# EAGLE design led wall display (EAGLE 4.16)

## Sheet 1 of 3
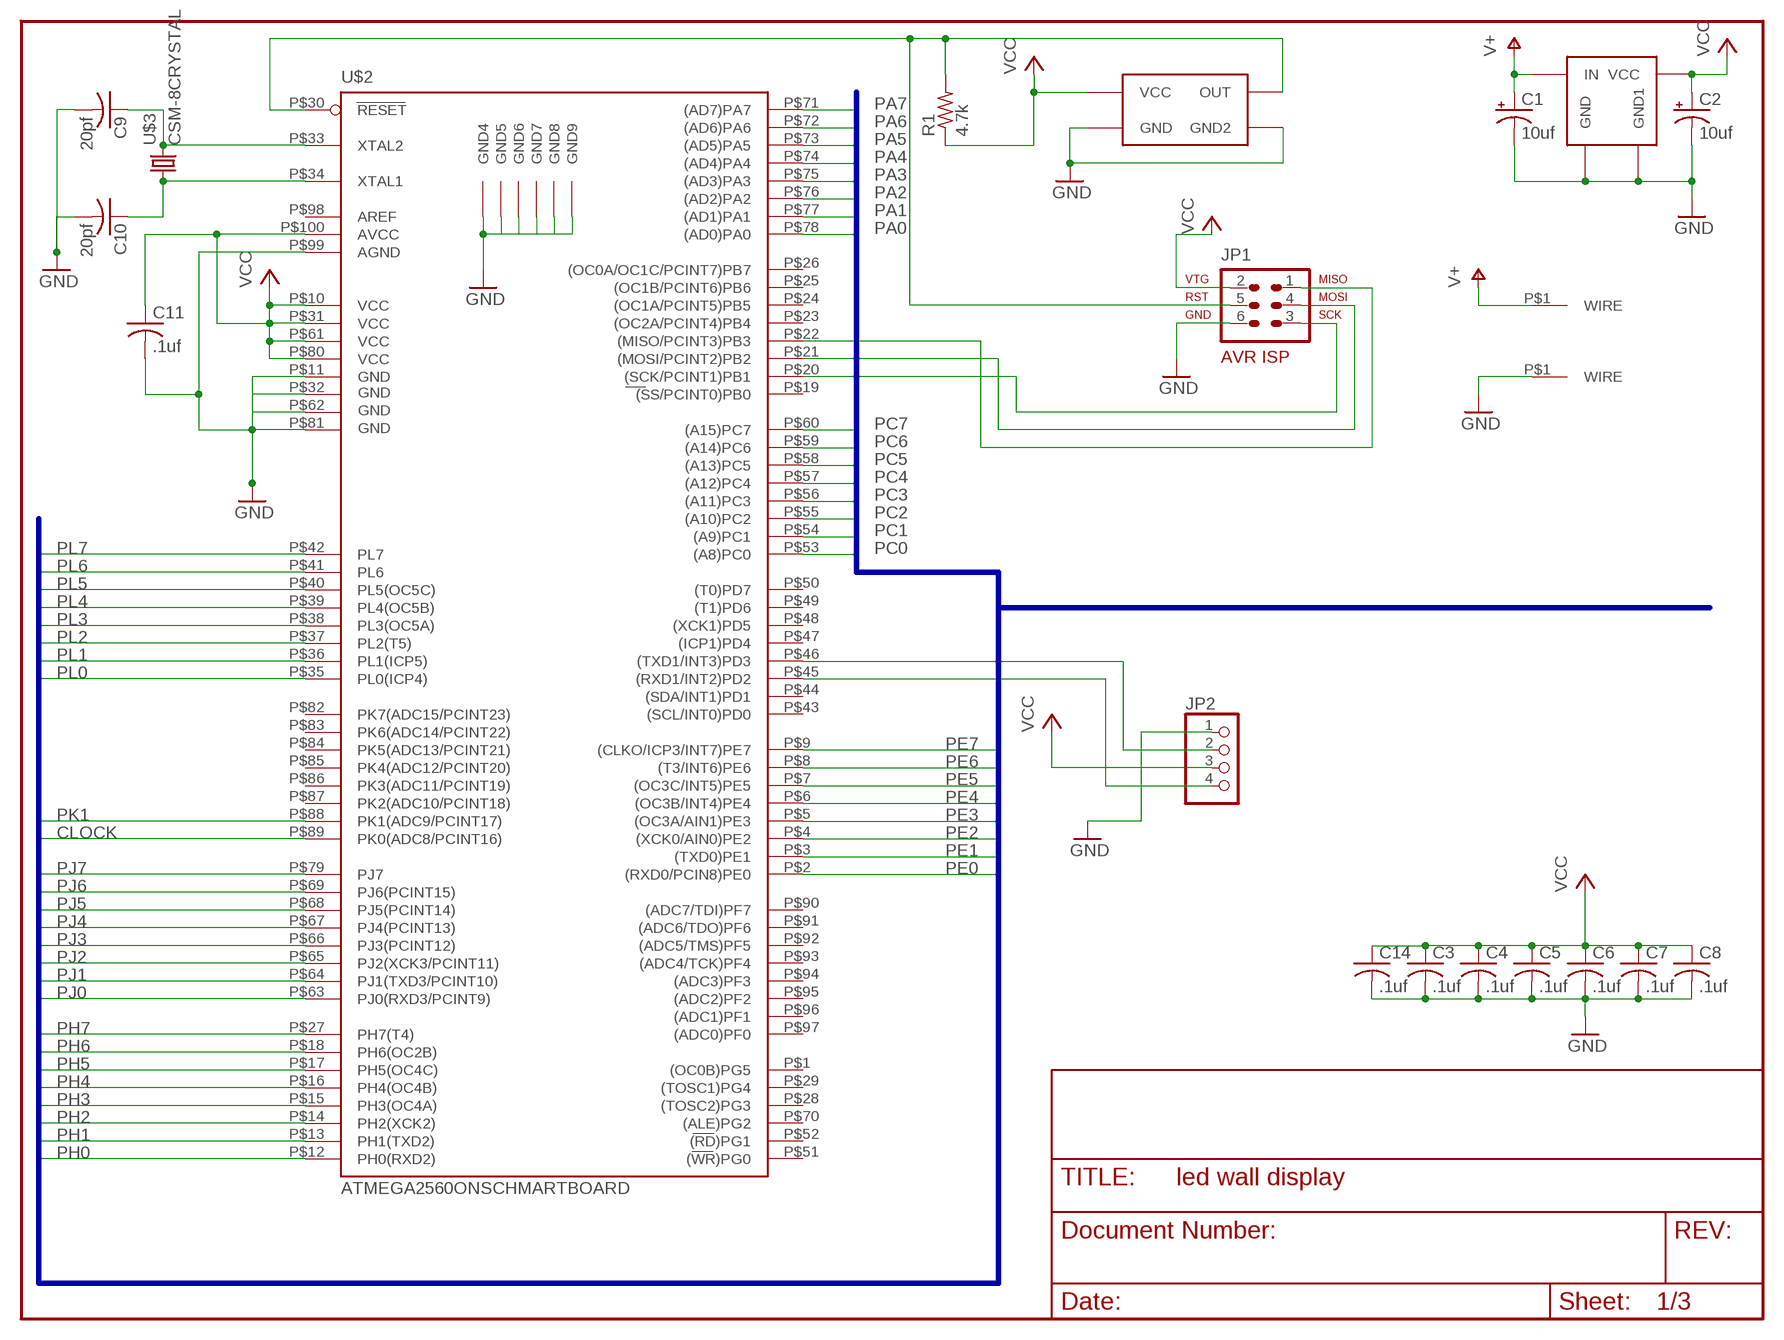
[diagram p0: schematic, sheet 1]

### Parts
C1  10uf  CPOL-USE2-5  [E2-5]
C2  10uf  CPOL-USE2-5  [E2-5]
C3  .1uf  C-USC1206  [C1206]
C4  .1uf  C-USC1206  [C1206]
C5  .1uf  C-USC1206  [C1206]
C6  .1uf  C-USC1206  [C1206]
C7  .1uf  C-USC1206  [C1206]
C8  .1uf  C-USC1206  [C1206]
C9  20pf  C-USC1206  [C1206]
C10  20pf  C-USC1206  [C1206]
C11  .1uf  C-USC1206  [C1206]
C14  .1uf  C-USC1206  [C1206]
JP1  AVR-ISP-6  [AVR-ISP-6]
JP2  PINHD-1X4  [1X04]
R1  4.7k  R-US_0411/12  [0411/12]
U$1  ZM33064  [SOT223]
U$2  ATMEGA2560ONSCHMARTBOARD  [SCHMARTBOARD]
U$3  CSM-8CRYSTAL  [CSM-8A]
U$4  5VREGD2PAK/A  [TO263]
U$5  WIREHOLE  [WIREHOLE]
U$6  WIREHOLE  [WIREHOLE]

### Nets
CLOCK: U$2.P$89(PK0(ADC8/PCINT16)) ; also sheet 2,3
GND: C1.- C2.- C3.2 C4.2 C5.2 C6.2 C7.2 C8.2 C9.2 C10.2 C11.2 C14.2 JP1.6 JP2.1 U$1.2(GND) U$1.4(GND2) U$2.P$11(GND) U$2.P$32(GND1) U$2.P$62(GND2) U$2.P$81(GND3) U$2.P$99(AGND) U$2.P$101(GND4) U$2.P$102(GND5) U$2.P$103(GND6) U$2.P$104(GND7) U$2.P$105(GND8) U$2.P$106(GND9) U$4.P$1(GND) U$4.P$3(GND1) U$6.P$1(WIRE) ; also sheet 2,3
N$1: C10.1 U$2.P$34(XTAL1) U$3.1
N$2: C9.1 U$2.P$33(XTAL2) U$3.2
N$3: JP1.5 R1.2 U$1.3(OUT) U$2.P$30(RESET)
N$4: JP1.3 U$2.P$20((SCK/PCINT1)PB1)
N$5: JP1.4 U$2.P$21((MOSI/PCINT2)PB2)
N$6: JP1.1 U$2.P$22((MISO/PCINT3)PB3)
N$121: JP2.2 U$2.P$46((TXD1/INT3)PD3)
N$122: JP2.4 U$2.P$45((RXD1/INT2)PD2)
PA0: U$2.P$78((AD0)PA0) ; also sheet 2
PA1: U$2.P$77((AD1)PA1) ; also sheet 2
PA2: U$2.P$76((AD2)PA2) ; also sheet 2
PA3: U$2.P$75((AD3)PA3) ; also sheet 2
PA4: U$2.P$74((AD4)PA4) ; also sheet 2
PA5: U$2.P$73((AD5)PA5) ; also sheet 2
PA6: U$2.P$72((AD6)PA6) ; also sheet 2
PA7: U$2.P$71((AD7)PA7) ; also sheet 2
PC0: U$2.P$53((A8)PC0) ; also sheet 2
PC1: U$2.P$54((A9)PC1) ; also sheet 2
PC2: U$2.P$55((A10)PC2) ; also sheet 2
PC3: U$2.P$56((A11)PC3) ; also sheet 2
PC4: U$2.P$57((A12)PC4) ; also sheet 2
PC5: U$2.P$58((A13)PC5) ; also sheet 2
PC6: U$2.P$59((A14)PC6) ; also sheet 2
PC7: U$2.P$60((A15)PC7) ; also sheet 2
PE0: U$2.P$2((RXD0/PCIN8)PE0) ; also sheet 2
PE1: U$2.P$3((TXD0)PE1) ; also sheet 2
PE2: U$2.P$4((XCK0/AIN0)PE2) ; also sheet 2
PE3: U$2.P$5((OC3A/AIN1)PE3) ; also sheet 2
PE4: U$2.P$6((OC3B/INT4)PE4) ; also sheet 2
PE5: U$2.P$7((OC3C/INT5)PE5) ; also sheet 2
PE6: U$2.P$8((T3/INT6)PE6) ; also sheet 2
PE7: U$2.P$9((CLKO/ICP3/INT7)PE7) ; also sheet 2
PH0: U$2.P$12(PH0(RXD2)) ; also sheet 2
PH1: U$2.P$13(PH1(TXD2)) ; also sheet 2
PH2: U$2.P$14(PH2(XCK2)) ; also sheet 2
PH3: U$2.P$15(PH3(OC4A)) ; also sheet 2
PH4: U$2.P$16(PH4(OC4B)) ; also sheet 2
PH5: U$2.P$17(PH5(OC4C)) ; also sheet 2
PH6: U$2.P$18(PH6(OC2B)) ; also sheet 2
PH7: U$2.P$27(PH7(T4)) ; also sheet 2
PJ0: U$2.P$63(PJ0(RXD3/PCINT9)) ; also sheet 2
PJ1: U$2.P$64(PJ1(TXD3/PCINT10)) ; also sheet 2
PJ2: U$2.P$65(PJ2(XCK3/PCINT11)) ; also sheet 2
PJ3: U$2.P$66(PJ3(PCINT12)) ; also sheet 2
PJ4: U$2.P$67(PJ4(PCINT13)) ; also sheet 2
PJ5: U$2.P$68(PJ5(PCINT14)) ; also sheet 2
PJ6: U$2.P$69(PJ6(PCINT15)) ; also sheet 2
PJ7: U$2.P$79(PJ7) ; also sheet 2
PK1: U$2.P$88(PK1(ADC9/PCINT17)) ; also sheet 3
PL0: U$2.P$35(PL0(ICP4)) ; also sheet 2
PL1: U$2.P$36(PL1(ICP5)) ; also sheet 2
PL2: U$2.P$37(PL2(T5)) ; also sheet 2
PL3: U$2.P$38(PL3(OC5A)) ; also sheet 2
PL4: U$2.P$39(PL4(OC5B)) ; also sheet 2
PL5: U$2.P$40(PL5(OC5C)) ; also sheet 2
PL6: U$2.P$41(PL6) ; also sheet 2
PL7: U$2.P$42(PL7) ; also sheet 2
V+: C1.+ U$4.P$2(IN) U$5.P$1(WIRE)
VCC: C2.+ C3.1 C4.1 C5.1 C6.1 C7.1 C8.1 C11.1 C14.1 JP1.2 JP2.3 R1.1 U$1.1(VCC) U$2.P$10(VCC) U$2.P$31(VCC1) U$2.P$61(VCC2) U$2.P$80(VCC3) U$2.P$100(AVCC) U$4.P$4(VCC)
Unconnected: U$2.P$1((OC0B)PG5) U$2.P$19((SS/PCINT0)PB0) U$2.P$23((OC2A/PCINT4)PB4) U$2.P$24((OC1A/PCINT5)PB5) U$2.P$25((OC1B/PCINT6)PB6) U$2.P$26((OC0A/OC1C/PCINT7)PB7) U$2.P$28((TOSC2)PG3) U$2.P$29((TOSC1)PG4) U$2.P$43((SCL/INT0)PD0) U$2.P$44((SDA/INT1)PD1) U$2.P$47((ICP1)PD4) U$2.P$48((XCK1)PD5) U$2.P$49((T1)PD6) U$2.P$50((T0)PD7) U$2.P$51((WR)PG0) U$2.P$52((RD)PG1) U$2.P$70((ALE)PG2) U$2.P$82(PK7(ADC15/PCINT23)) U$2.P$83(PK6(ADC14/PCINT22)) U$2.P$84(PK5(ADC13/PCINT21)) U$2.P$85(PK4(ADC12/PCINT20)) U$2.P$86(PK3(ADC11/PCINT19)) U$2.P$87(PK2(ADC10/PCINT18)) U$2.P$90((ADC7/TDI)PF7) U$2.P$91((ADC6/TDO)PF6) U$2.P$92((ADC5/TMS)PF5) U$2.P$93((ADC4/TCK)PF4) U$2.P$94((ADC3)PF3) U$2.P$95((ADC2)PF2) U$2.P$96((ADC1)PF1) U$2.P$97((ADC0)PF0) U$2.P$98(AREF)

### Buses
PA[0..7],PC[0..7],PE[0..7],PH[0..7],PJ[0..7],PL[0..7],CLOCK,PK1

## Sheet 2 of 3
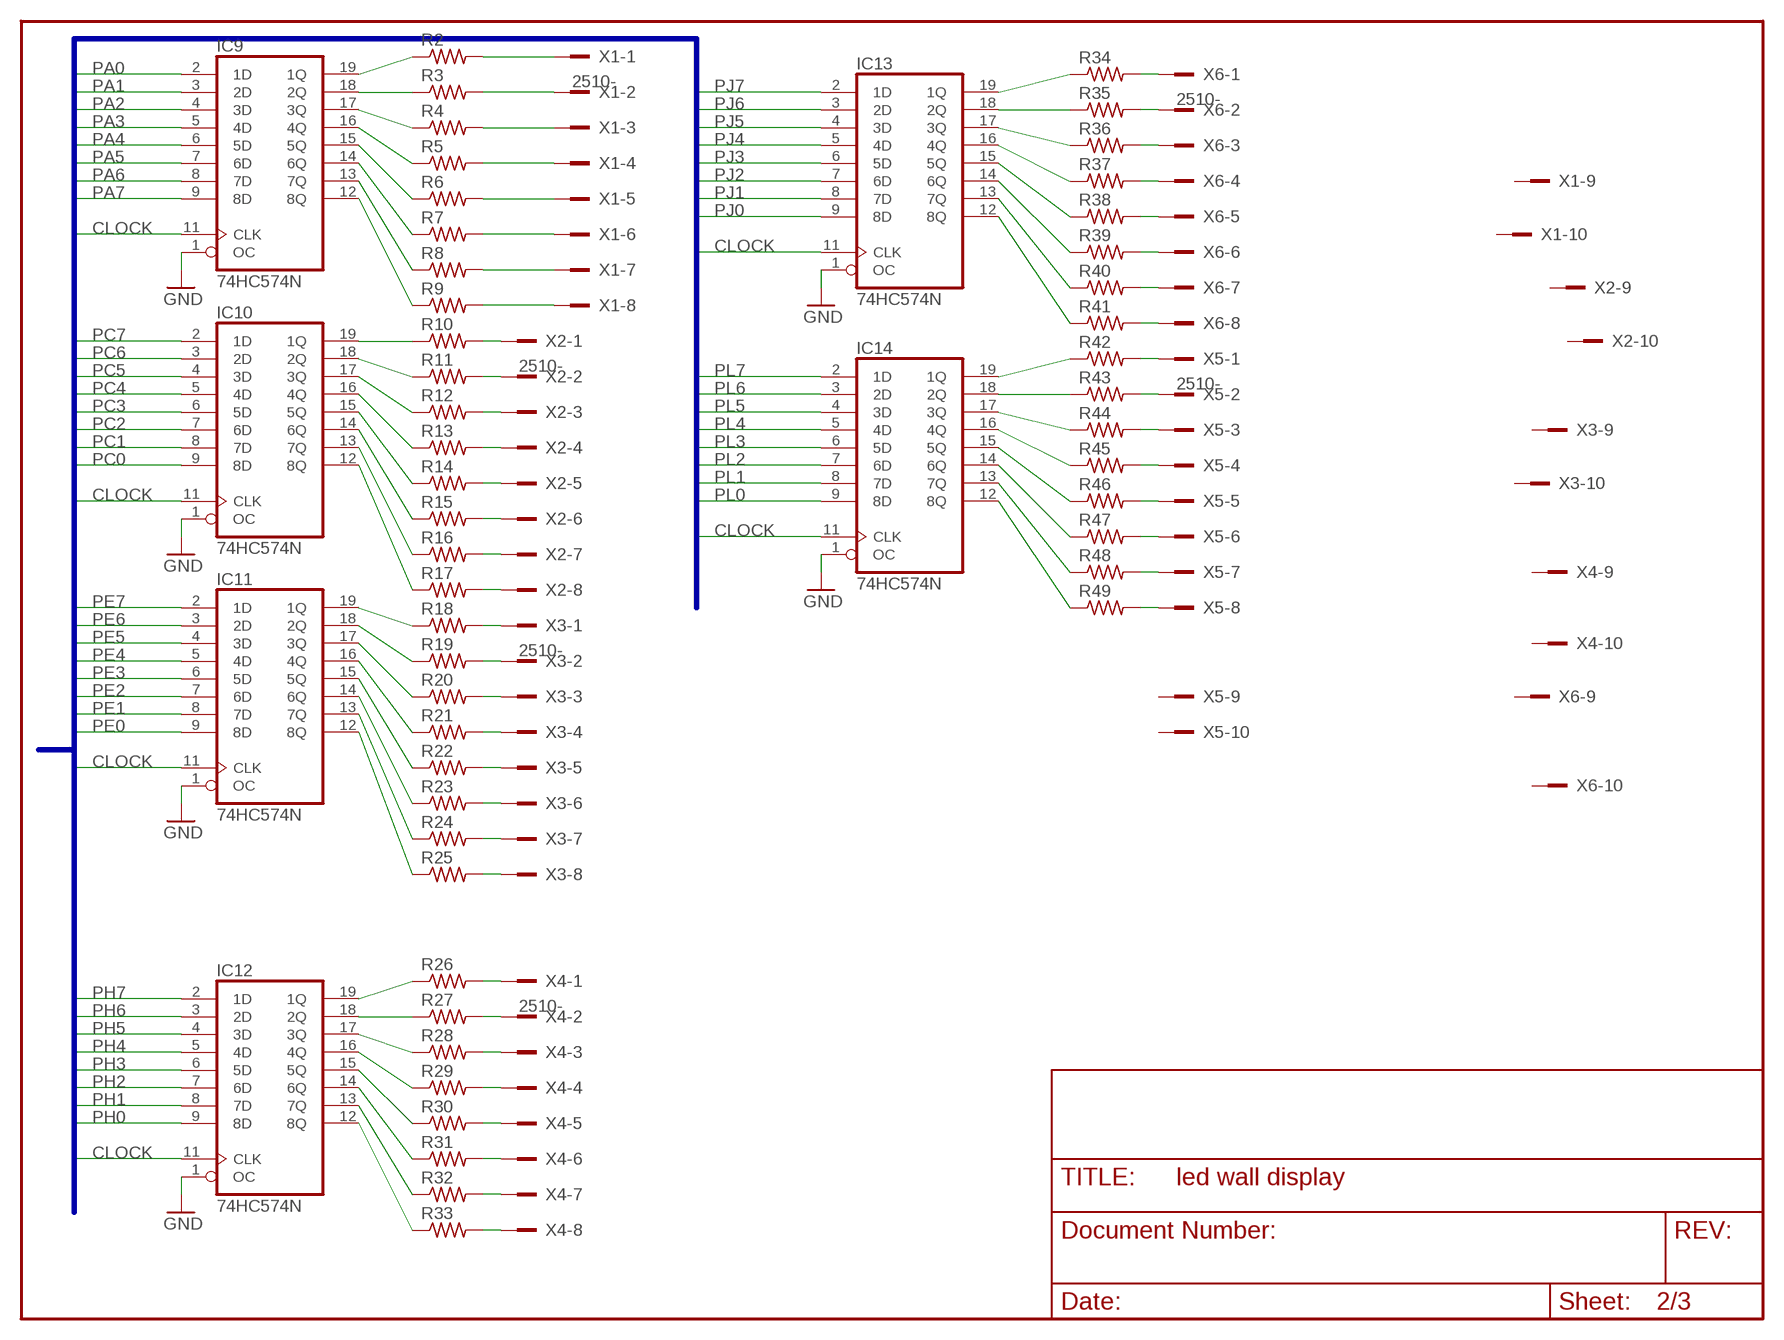
[diagram p1: schematic, sheet 2]

### Parts
IC9  74HC574N  [DIL20]
IC10  74HC574N  [DIL20]
IC11  74HC574N  [DIL20]
IC12  74HC574N  [DIL20]
IC13  74HC574N  [DIL20]
IC14  74HC574N  [DIL20]
R2  R-US_0411/12  [0411/12]
R3  R-US_0411/12  [0411/12]
R4  R-US_0411/12  [0411/12]
R5  R-US_0411/12  [0411/12]
R6  R-US_0411/12  [0411/12]
R7  R-US_0411/12  [0411/12]
R8  R-US_0411/12  [0411/12]
R9  R-US_0411/12  [0411/12]
R10  R-US_0411/12  [0411/12]
R11  R-US_0411/12  [0411/12]
R12  R-US_0411/12  [0411/12]
R13  R-US_0411/12  [0411/12]
R14  R-US_0411/12  [0411/12]
R15  R-US_0411/12  [0411/12]
R16  R-US_0411/12  [0411/12]
R17  R-US_0411/12  [0411/12]
R18  R-US_0411/12  [0411/12]
R19  R-US_0411/12  [0411/12]
R20  R-US_0411/12  [0411/12]
R21  R-US_0411/12  [0411/12]
R22  R-US_0411/12  [0411/12]
R23  R-US_0411/12  [0411/12]
R24  R-US_0411/12  [0411/12]
R25  R-US_0411/12  [0411/12]
R26  R-US_0411/12  [0411/12]
R27  R-US_0411/12  [0411/12]
R28  R-US_0411/12  [0411/12]
R29  R-US_0411/12  [0411/12]
R30  R-US_0411/12  [0411/12]
R31  R-US_0411/12  [0411/12]
R32  R-US_0411/12  [0411/12]
R33  R-US_0411/12  [0411/12]
R34  R-US_0411/12  [0411/12]
R35  R-US_0411/12  [0411/12]
R36  R-US_0411/12  [0411/12]
R37  R-US_0411/12  [0411/12]
R38  R-US_0411/12  [0411/12]
R39  R-US_0411/12  [0411/12]
R40  R-US_0411/12  [0411/12]
R41  R-US_0411/12  [0411/12]
R42  R-US_0411/12  [0411/12]
R43  R-US_0411/12  [0411/12]
R44  R-US_0411/12  [0411/12]
R45  R-US_0411/12  [0411/12]
R46  R-US_0411/12  [0411/12]
R47  R-US_0411/12  [0411/12]
R48  R-US_0411/12  [0411/12]
R49  R-US_0411/12  [0411/12]
X1  2510-  [PAK100/2500-10]
X2  2510-  [PAK100/2500-10]
X3  2510-  [PAK100/2500-10]
X4  2510-  [PAK100/2500-10]
X5  2510-  [PAK100/2500-10]
X6  2510-  [PAK100/2500-10]

### Nets
CLOCK: IC9.11(CLK) IC10.11(CLK) IC11.11(CLK) IC12.11(CLK) IC13.11(CLK) IC14.11(CLK) ; also sheet 1,3
GND: IC9.1(OC) IC10.1(OC) IC11.1(OC) IC12.1(OC) IC13.1(OC) IC14.1(OC) ; also sheet 1,3
N$7: IC9.19(1Q) R2.1
N$8: IC9.18(2Q) R3.1
N$9: IC9.17(3Q) R4.1
N$10: IC9.16(4Q) R5.1
N$11: IC9.15(5Q) R6.1
N$12: IC9.14(6Q) R7.1
N$13: IC9.13(7Q) R8.1
N$14: IC9.12(8Q) R9.1
N$15: IC10.19(1Q) R10.1
N$16: IC10.18(2Q) R11.1
N$17: IC10.17(3Q) R12.1
N$18: IC10.16(4Q) R13.1
N$19: IC10.15(5Q) R14.1
N$20: IC10.14(6Q) R15.1
N$21: IC10.13(7Q) R16.1
N$22: IC10.12(8Q) R17.1
N$23: IC11.19(1Q) R18.1
N$40: IC11.18(2Q) R19.1
N$41: IC11.17(3Q) R20.1
N$42: IC11.16(4Q) R21.1
N$43: IC11.15(5Q) R22.1
N$44: IC11.14(6Q) R23.1
N$45: IC11.13(7Q) R24.1
N$46: IC11.12(8Q) R25.1
N$47: IC12.19(1Q) R26.1
N$48: IC12.18(2Q) R27.1
N$49: IC12.17(3Q) R28.1
N$50: IC12.16(4Q) R29.1
N$51: IC12.15(5Q) R30.1
N$52: IC12.14(6Q) R31.1
N$53: IC12.13(7Q) R32.1
N$54: IC12.12(8Q) R33.1
N$55: R2.2 X1.1
N$56: R3.2 X1.2
N$57: R4.2 X1.3
N$58: R5.2 X1.4
N$59: R6.2 X1.5
N$60: R7.2 X1.6
N$61: R8.2 X1.7
N$62: R9.2 X1.8
N$63: R10.2 X2.1
N$64: R11.2 X2.2
N$65: R12.2 X2.3
N$66: R13.2 X2.4
N$67: R14.2 X2.5
N$68: R15.2 X2.6
N$69: R16.2 X2.7
N$70: R17.2 X2.8
N$71: R18.2 X3.1
N$72: R19.2 X3.2
N$73: R20.2 X3.3
N$74: R21.2 X3.4
N$75: R22.2 X3.5
N$76: R23.2 X3.6
N$77: R24.2 X3.7
N$78: R25.2 X3.8
N$79: R26.2 X4.1
N$80: R27.2 X4.2
N$81: R33.2 X4.8
N$82: R32.2 X4.7
N$83: R31.2 X4.6
N$84: R30.2 X4.5
N$85: R29.2 X4.4
N$86: R28.2 X4.3
N$87: R34.2 X6.1
N$88: R35.2 X6.2
N$89: R36.2 X6.3
N$90: R37.2 X6.4
N$91: R38.2 X6.5
N$92: R39.2 X6.6
N$93: R40.2 X6.7
N$94: R41.2 X6.8
N$95: R42.2 X5.1
N$96: R43.2 X5.2
N$97: R44.2 X5.3
N$98: R45.2 X5.4
N$99: R46.2 X5.5
N$100: R47.2 X5.6
N$101: R48.2 X5.7
N$102: R49.2 X5.8
N$103: IC13.19(1Q) R34.1
N$104: IC13.18(2Q) R35.1
N$105: IC13.17(3Q) R36.1
N$106: IC13.16(4Q) R37.1
N$107: IC13.15(5Q) R38.1
N$108: IC13.14(6Q) R39.1
N$109: IC13.13(7Q) R40.1
N$110: IC13.12(8Q) R41.1
N$111: IC14.19(1Q) R42.1
N$112: IC14.18(2Q) R43.1
N$113: IC14.17(3Q) R44.1
N$114: IC14.16(4Q) R45.1
N$115: IC14.15(5Q) R46.1
N$116: IC14.14(6Q) R47.1
N$117: IC14.13(7Q) R48.1
N$118: IC14.12(8Q) R49.1
PA0: IC9.2(1D) ; also sheet 1
PA1: IC9.3(2D) ; also sheet 1
PA2: IC9.4(3D) ; also sheet 1
PA3: IC9.5(4D) ; also sheet 1
PA4: IC9.6(5D) ; also sheet 1
PA5: IC9.7(6D) ; also sheet 1
PA6: IC9.8(7D) ; also sheet 1
PA7: IC9.9(8D) ; also sheet 1
PC0: IC10.9(8D) ; also sheet 1
PC1: IC10.8(7D) ; also sheet 1
PC2: IC10.7(6D) ; also sheet 1
PC3: IC10.6(5D) ; also sheet 1
PC4: IC10.5(4D) ; also sheet 1
PC5: IC10.4(3D) ; also sheet 1
PC6: IC10.3(2D) ; also sheet 1
PC7: IC10.2(1D) ; also sheet 1
PE0: IC11.9(8D) ; also sheet 1
PE1: IC11.8(7D) ; also sheet 1
PE2: IC11.7(6D) ; also sheet 1
PE3: IC11.6(5D) ; also sheet 1
PE4: IC11.5(4D) ; also sheet 1
PE5: IC11.4(3D) ; also sheet 1
PE6: IC11.3(2D) ; also sheet 1
PE7: IC11.2(1D) ; also sheet 1
PH0: IC12.9(8D) ; also sheet 1
PH1: IC12.8(7D) ; also sheet 1
PH2: IC12.7(6D) ; also sheet 1
PH3: IC12.6(5D) ; also sheet 1
PH4: IC12.5(4D) ; also sheet 1
PH5: IC12.4(3D) ; also sheet 1
PH6: IC12.3(2D) ; also sheet 1
PH7: IC12.2(1D) ; also sheet 1
PJ0: IC13.9(8D) ; also sheet 1
PJ1: IC13.8(7D) ; also sheet 1
PJ2: IC13.7(6D) ; also sheet 1
PJ3: IC13.6(5D) ; also sheet 1
PJ4: IC13.5(4D) ; also sheet 1
PJ5: IC13.4(3D) ; also sheet 1
PJ6: IC13.3(2D) ; also sheet 1
PJ7: IC13.2(1D) ; also sheet 1
PL0: IC14.9(8D) ; also sheet 1
PL1: IC14.8(7D) ; also sheet 1
PL2: IC14.7(6D) ; also sheet 1
PL3: IC14.6(5D) ; also sheet 1
PL4: IC14.5(4D) ; also sheet 1
PL5: IC14.4(3D) ; also sheet 1
PL6: IC14.3(2D) ; also sheet 1
PL7: IC14.2(1D) ; also sheet 1
Unconnected: X1.9 X1.10 X2.9 X2.10 X3.9 X3.10 X4.9 X4.10 X5.9 X5.10 X6.9 X6.10

### Buses
PA[0..7],PC[0..7],PE[0..7],PH[0..7],PJ[0..7],PL[0..7],CLOCK,PK1

## Sheet 3 of 3
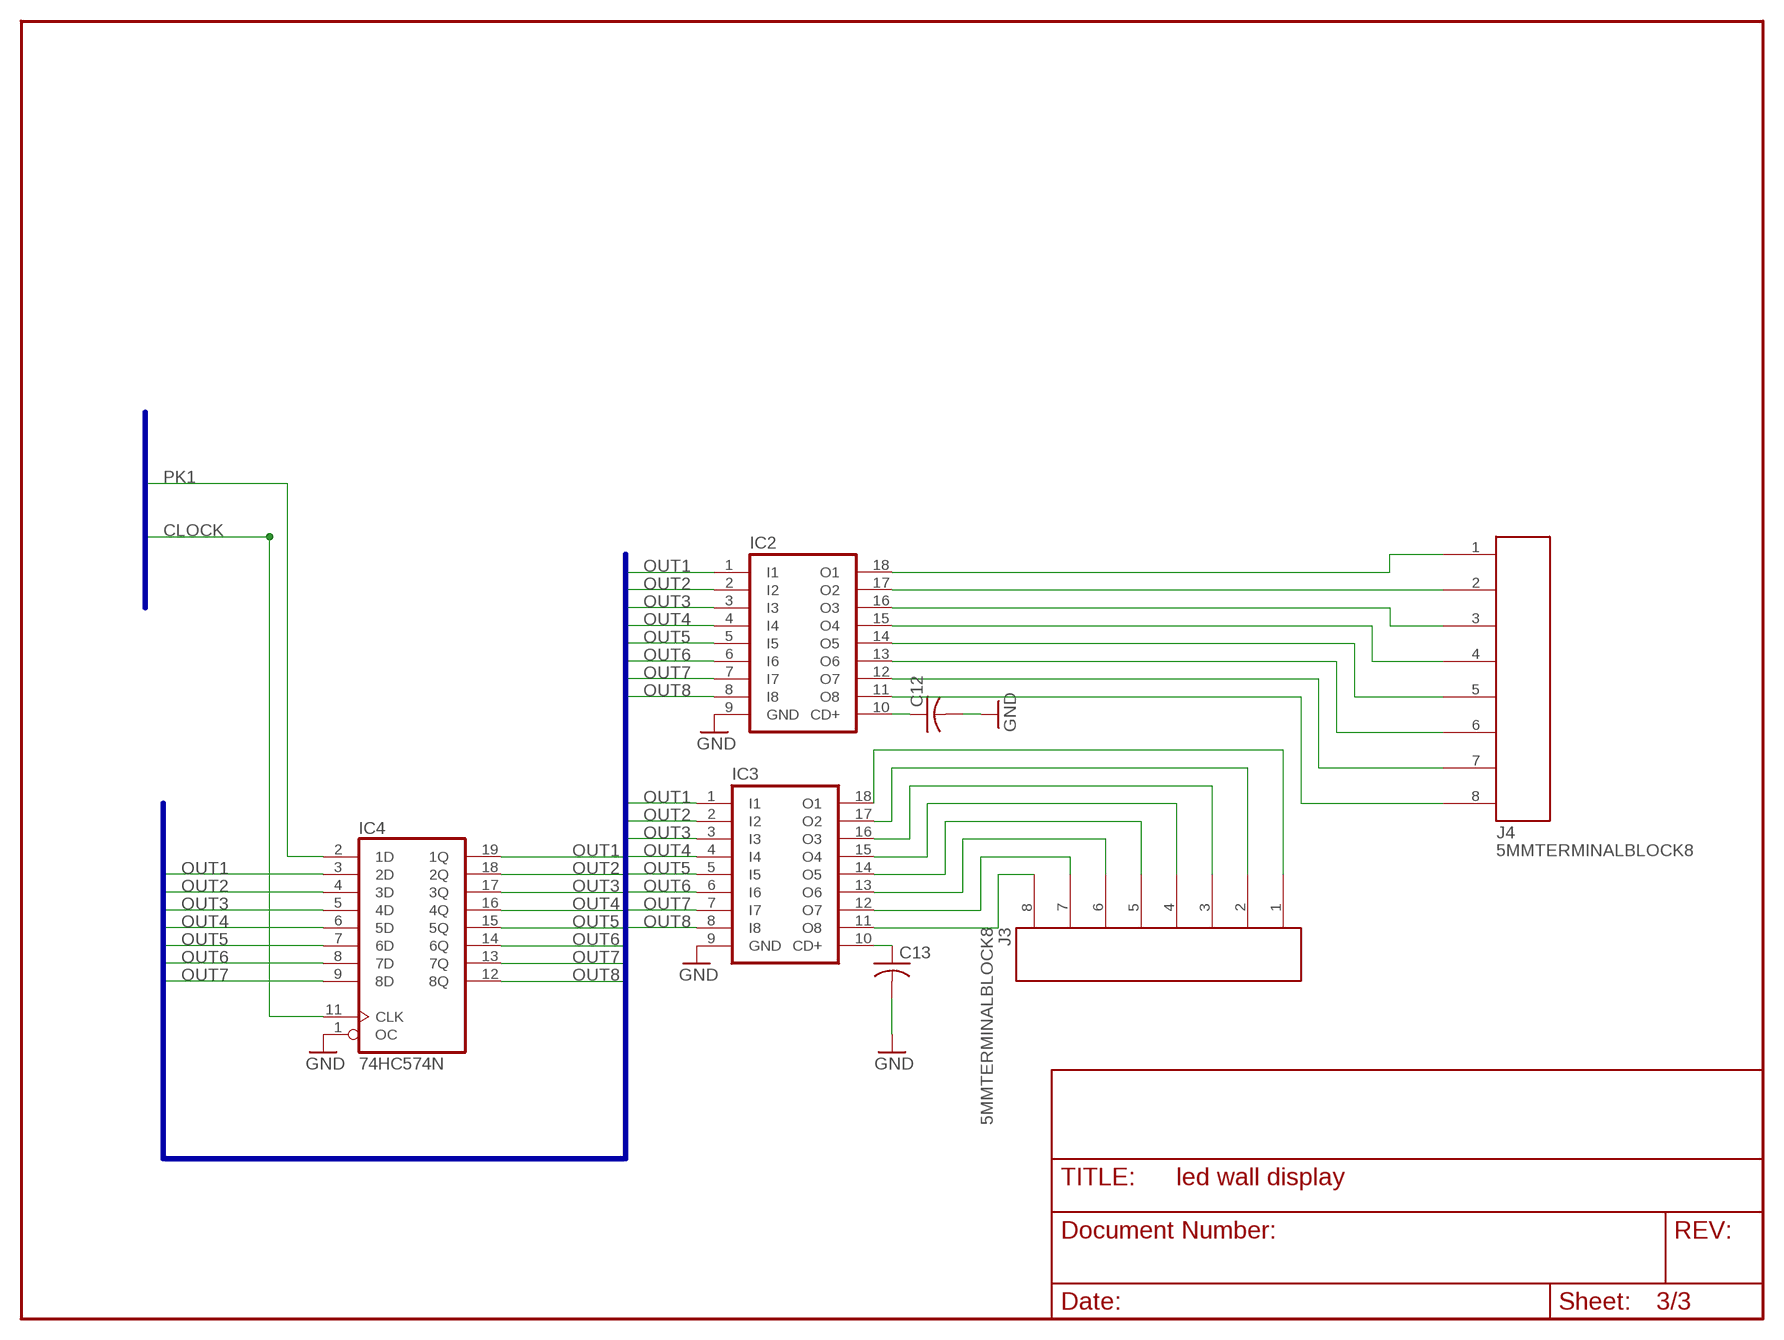
[diagram p2: schematic, sheet 3]

### Parts
C12  C-USC1206  [C1206]
C13  C-USC1206  [C1206]
IC2  ULN2803A  [DIL18]
IC3  ULN2803A  [DIL18]
IC4  74HC574N  [DIL20]
J3  5MMTERMINALBLOCK8  [5MMTERMINALBLOCK8]
J4  5MMTERMINALBLOCK8  [5MMTERMINALBLOCK8]

### Nets
CLOCK: IC4.11(CLK) ; also sheet 1,2
GND: C12.2 C13.2 IC2.9(GND) IC3.9(GND) IC4.1(OC) ; also sheet 1,2
N$24: IC3.11(O8) J3.8
N$25: IC3.12(O7) J3.7
N$26: IC3.13(O6) J3.6
N$27: IC3.14(O5) J3.5
N$28: IC3.15(O4) J3.4
N$29: IC3.16(O3) J3.3
N$30: IC3.17(O2) J3.2
N$31: IC3.18(O1) J3.1
N$32: IC2.18(O1) J4.1
N$33: IC2.17(O2) J4.2
N$34: IC2.16(O3) J4.3
N$35: IC2.15(O4) J4.4
N$36: IC2.14(O5) J4.5
N$37: IC2.13(O6) J4.6
N$38: IC2.12(O7) J4.7
N$39: IC2.11(O8) J4.8
N$119: C12.1 IC2.10(CD+)
N$120: C13.1 IC3.10(CD+)
OUT1: IC2.1(I1) IC3.1(I1) IC4.3(2D) IC4.19(1Q)
OUT2: IC2.2(I2) IC3.2(I2) IC4.4(3D) IC4.18(2Q)
OUT3: IC2.3(I3) IC3.3(I3) IC4.5(4D) IC4.17(3Q)
OUT4: IC2.4(I4) IC3.4(I4) IC4.6(5D) IC4.16(4Q)
OUT5: IC2.5(I5) IC3.5(I5) IC4.7(6D) IC4.15(5Q)
OUT6: IC2.6(I6) IC3.6(I6) IC4.8(7D) IC4.14(6Q)
OUT7: IC2.7(I7) IC3.7(I7) IC4.9(8D) IC4.13(7Q)
OUT8: IC2.8(I8) IC3.8(I8) IC4.12(8Q)
PK1: IC4.2(1D) ; also sheet 1

### Buses
OUT[1..8]
PA[0..7],PC[0..7],PE[0..7],PH[0..7],PJ[0..7],PL[0..7],CLOCK,PK1

## Power pins joined to a net without a drawn wire
GND: IC4.10(GND) IC9.10(GND) IC10.10(GND) IC11.10(GND) IC12.10(GND) IC13.10(GND) IC14.10(GND)
VCC: IC4.20(VCC) IC9.20(VCC) IC10.20(VCC) IC11.20(VCC) IC12.20(VCC) IC13.20(VCC) IC14.20(VCC)

## Library data of the parts
C1 C2 = rcl:CPOL-US: POLARIZED CAPACITOR, American symbol
C3-C14 = rcl:C-US: CAPACITOR, American symbol
IC2 IC3 = uln-udn:ULN2803A: DRIVER ARRAY
IC4 IC9-IC14 = 74xx-us:74*574: 8-bit D type FLIP FLOP bus driver
J3 J4 = bk:5MMTERMINALBLOCK8: .2" 8 pos TERMINAL BLOCK
JP1 = atmel-1:AVR-ISP-6: AVR ISP-6 Serial Programming Header
JP2 = pinhead:PINHD-1X4: PIN HEADER
R1-R49 = rcl:R-US_: RESISTOR, American symbol
U$1 = LED Wall Display:ZM33064
U$2 = atmel-2005:ATMEGA2560ONSCHMARTBOARD
U$3 = Chuck:CSM-8CRYSTAL
U$4 = Chuck:5VREGD2PAK/A
U$5 U$6 = Chuck:WIREHOLE
X1-X6 = con-3m:2510-: 3M (TM) Pak 100 4-Wall Header Source: 3M

## Board
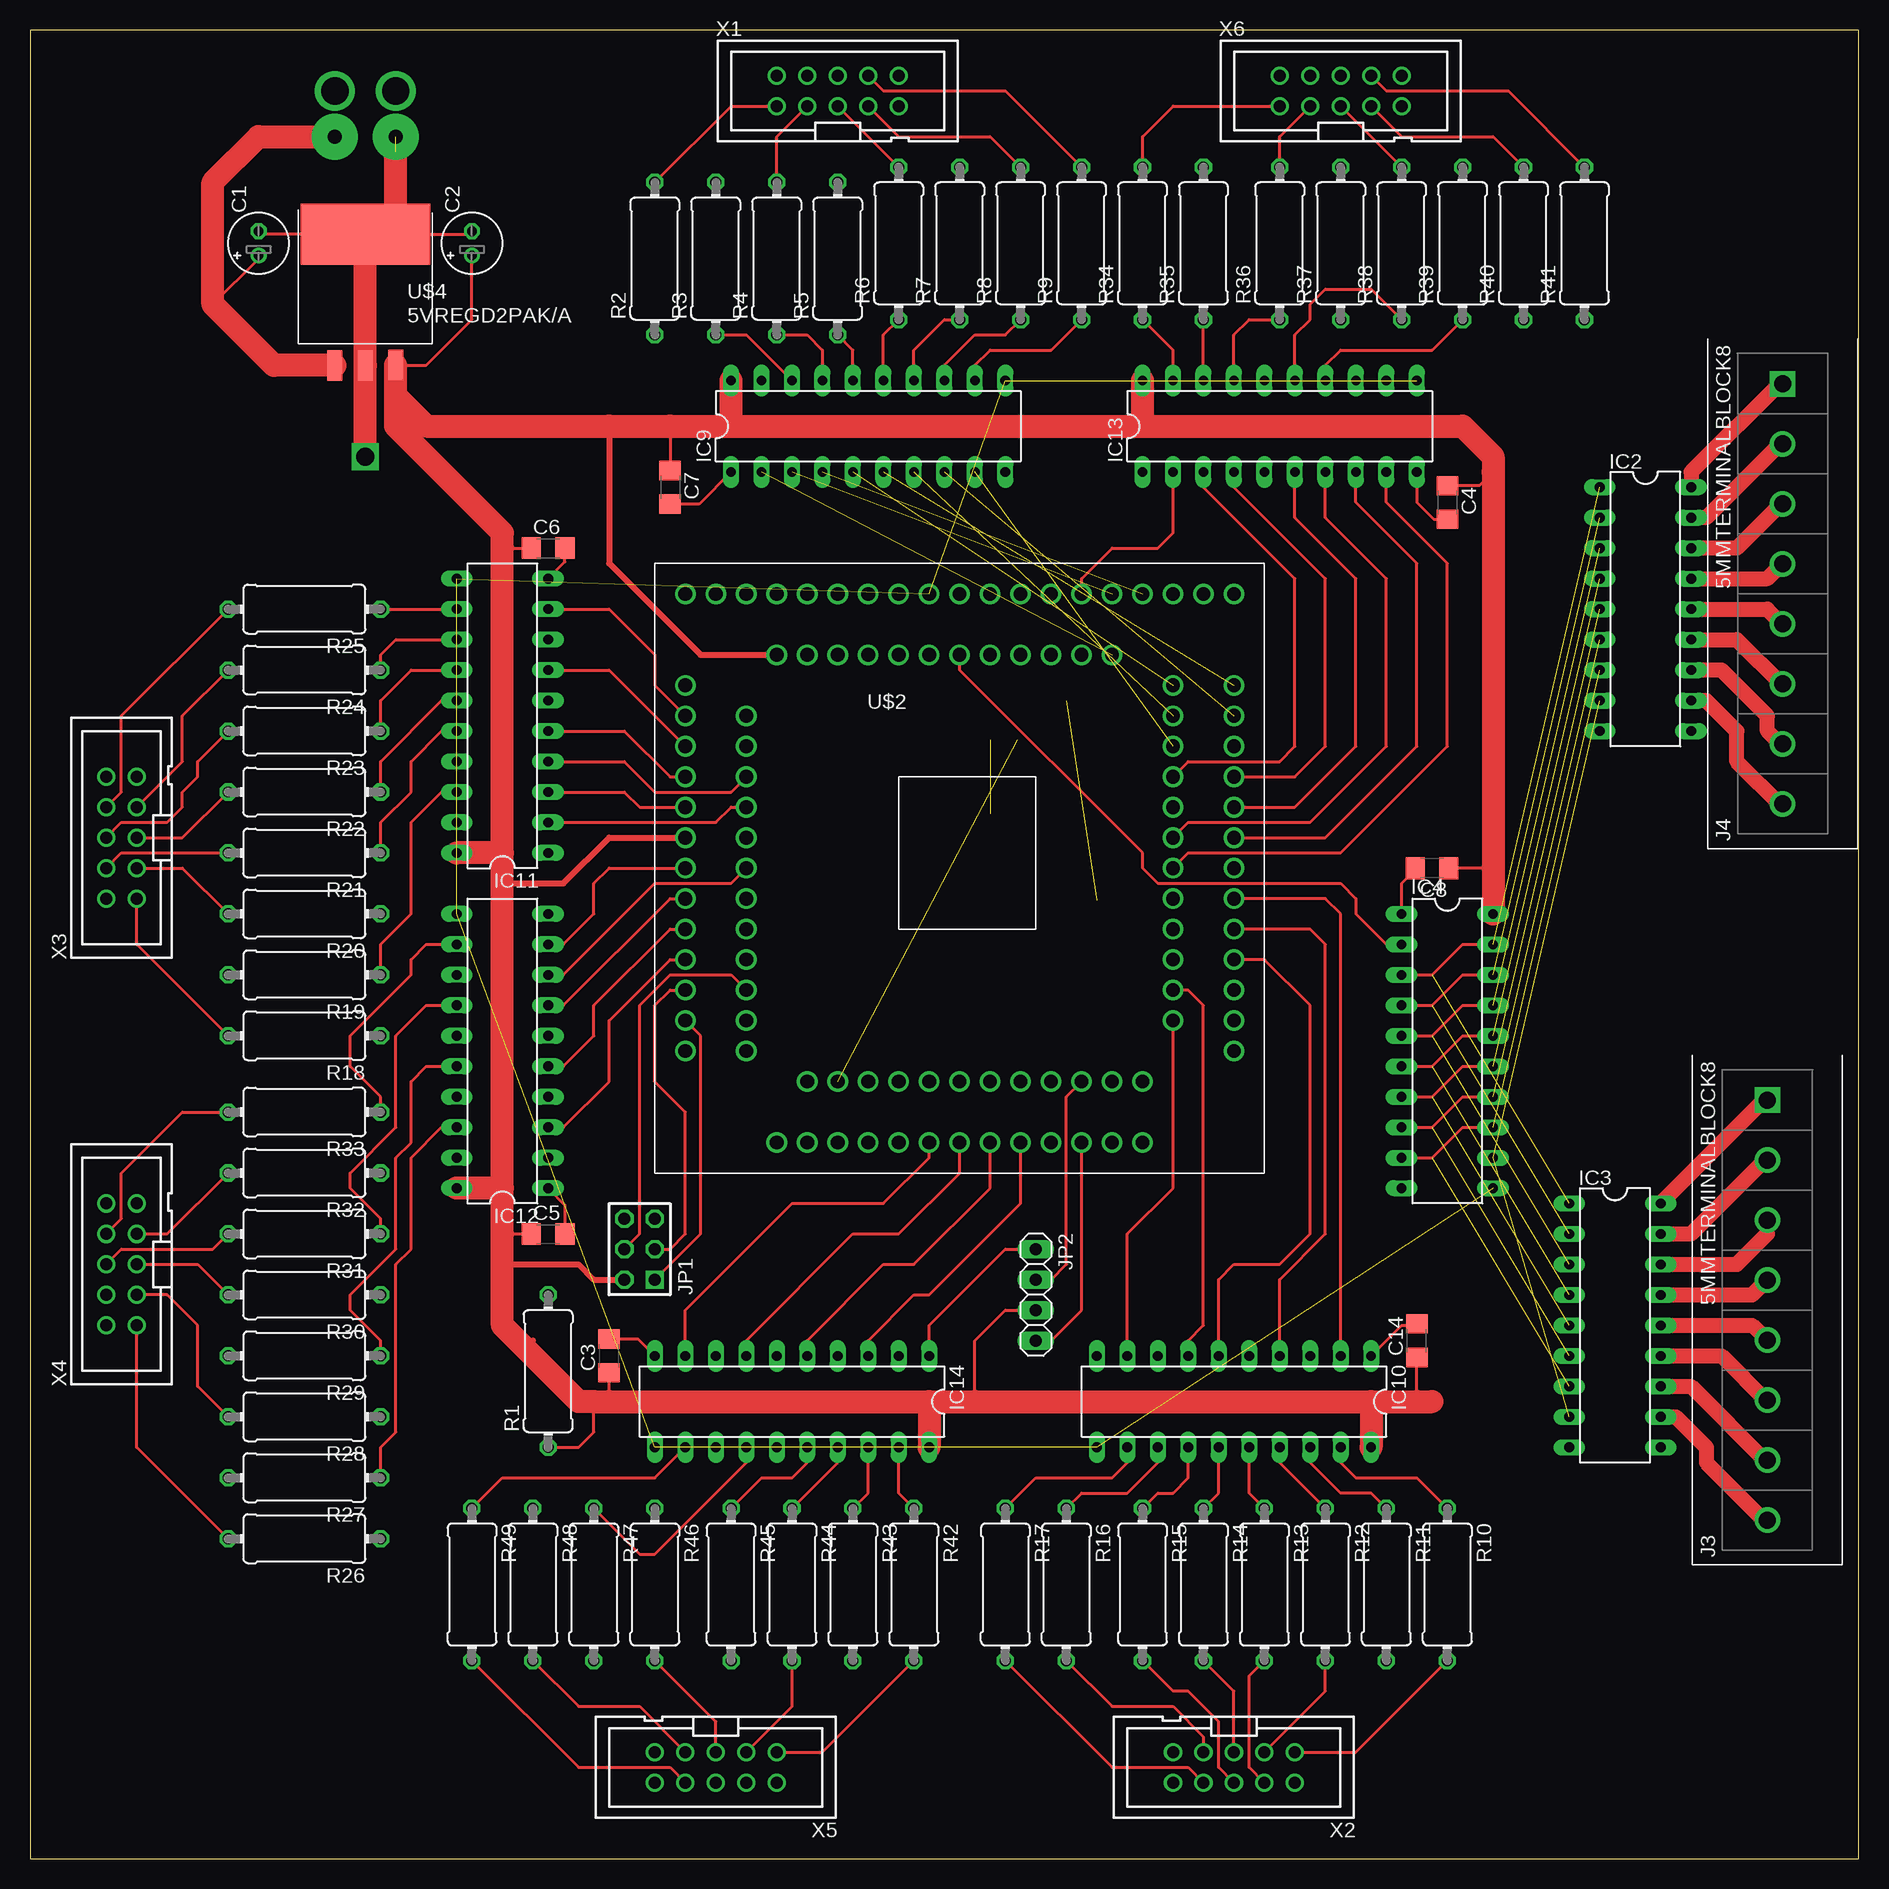
[diagram p3: board, top side]
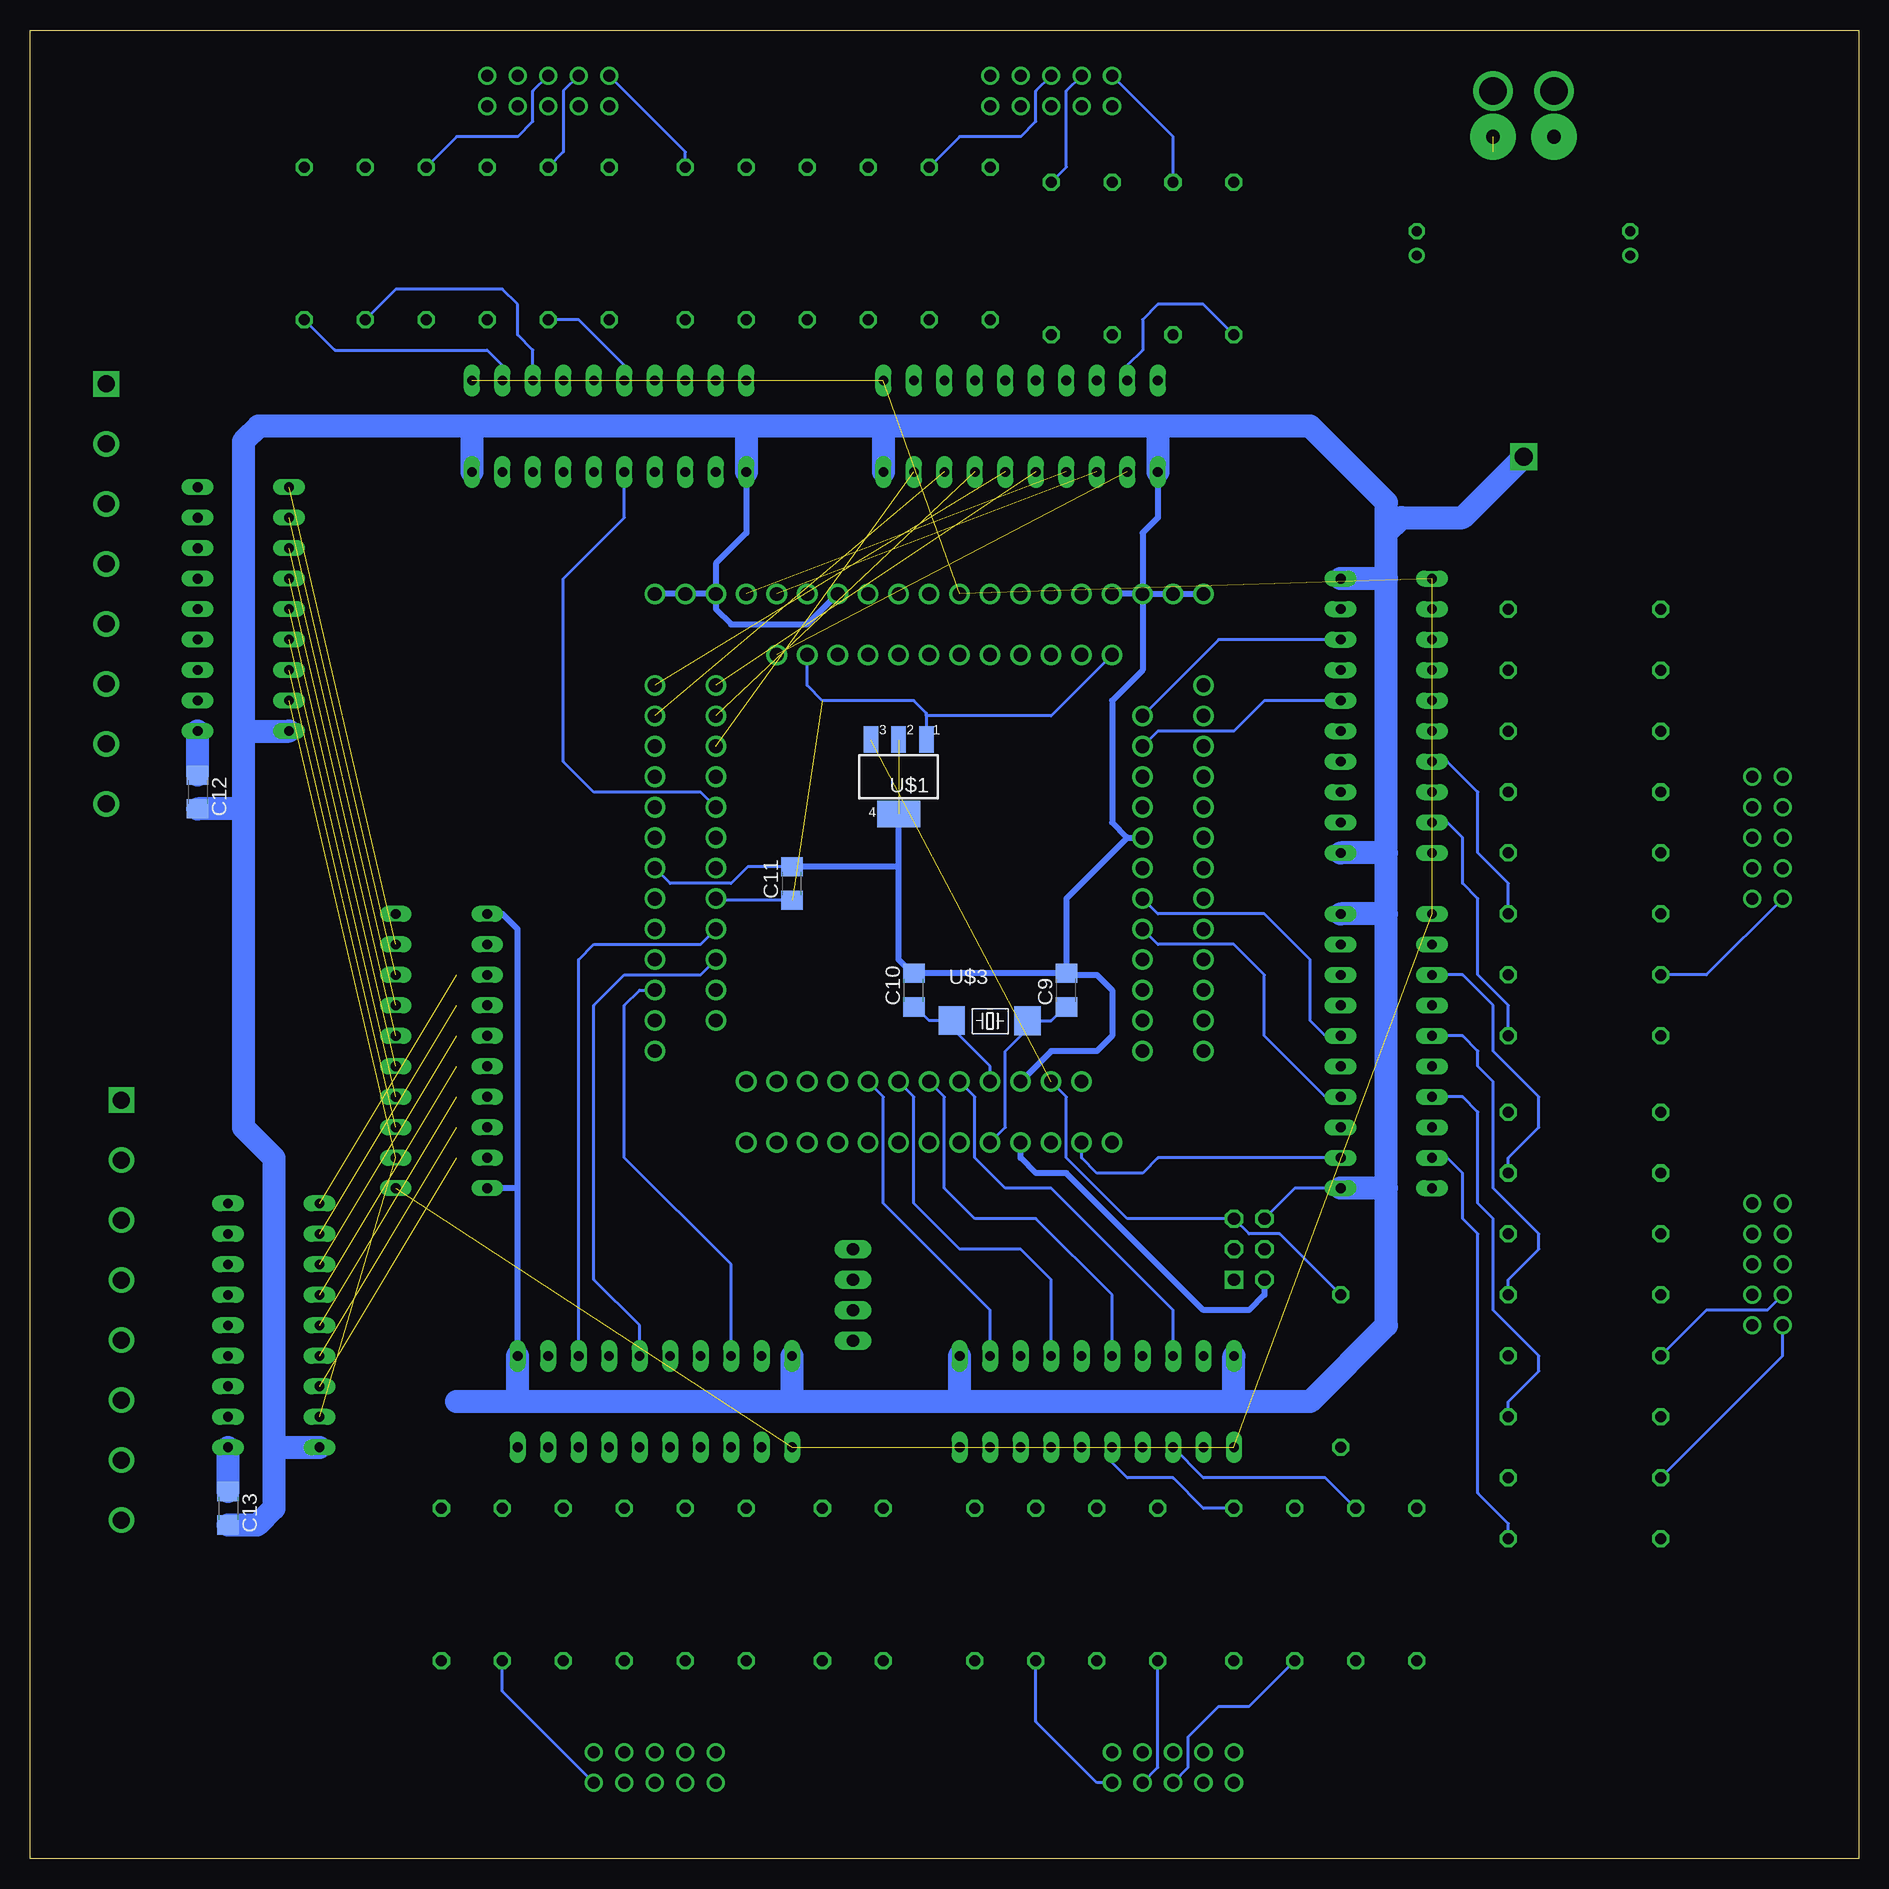
[diagram p4: board, bottom side, seen from below]

Size 152.4 x 152.4 mm. Coordinates in mm from the lower left corner, seen from the top.
Outline: 0,0 152.4,0 152.4,152.4 0,152.4 0,0
Copper layers (1*16): Top 0.035mm / dielectric 1.5mm / Bottom 0.035mm
Design rules "default": minimum track width 10mil, minimum drill 24mil, track to track 8mil, track to pad 8mil, pad to pad 8mil, via to via 8mil, smd to smd 8mil, copper to edge 40mil, drill to drill 8mil, minimum pad ring 10mil, minimum via ring 8mil, stop-mask expansion 4mil, vias tented up to drill 0mil, thermal gap 10mil

### Footprints (pad centres in the part's own frame; a part is rotated, then mirrored left to right if it is on the bottom)
E2-5 = drill 0.813 pad 1.27 round: + -1.016,0 | drill 0.813 pad 1.27 octagon: - 1.016,0
C1206 = smd 1.6 x 1.8: 1 -1.4,0; 2 1.4,0
DIL18 = drill 0.813 long: 1 -10.16,-3.81; 2 -7.62,-3.81; 3 -5.08,-3.81; 4 -2.54,-3.81; 5 0,-3.81; 6 2.54,-3.81; 7 5.08,-3.81; 8 7.62,-3.81; 9 10.16,-3.81; 10 10.16,3.81; 11 7.62,3.81; 12 5.08,3.81; 13 2.54,3.81; 14 0,3.81; 15 -2.54,3.81; 16 -5.08,3.81; 17 -7.62,3.81; 18 -10.16,3.81
DIL20 = drill 0.813 long: 1 -11.43,-3.81; 2 -8.89,-3.81; 3 -6.35,-3.81; 4 -3.81,-3.81; 5 -1.27,-3.81; 6 1.27,-3.81; 7 3.81,-3.81; 8 6.35,-3.81; 9 8.89,-3.81; 10 11.43,-3.81; 11 11.43,3.81; 12 8.89,3.81; 13 6.35,3.81; 14 3.81,3.81; 15 1.27,3.81; 16 -1.27,3.81; 17 -3.81,3.81; 18 -6.35,3.81; 19 -8.89,3.81; 20 -11.43,3.81
5MMTERMINALBLOCK8 = drill 1.422 square: 1 17.5,0 | drill 1.422 round: 2 12.5,0; 3 7.5,0; 4 2.5,0; 5 -2.5,0; 6 -7.5,0; 7 -12.5,0; 8 -17.5,0
AVR-ISP-6 = drill 1.016 square: 1 -2.54,-1.27 | drill 1.016 octagon: 2 -2.54,1.27; 3 0,-1.27; 4 0,1.27; 5 2.54,-1.27; 6 2.54,1.27
1X04 = drill 1.016 long: 1 -3.81,0; 2 -1.27,0; 3 1.27,0; 4 3.81,0
0411/12 = drill 0.914 octagon: 1 -6.35,0; 2 6.35,0
SOT223 = smd 1.219 x 2.235: 1 -2.311,-3.099; 2 0,-3.099; 3 2.311,-3.099 | smd 3.6 x 2.2: 4 0,3.099
SCHMARTBOARD = drill 1.143 round: P$1 -15.24,8.89; P$2 -15.24,6.35; P$3 -10.16,6.35; P$4 -15.24,3.81; P$5 -10.16,3.81; P$6 -15.24,1.27; P$7 -10.16,1.27; P$8 -15.24,-1.27; P$9 -10.16,-1.27; P$10 -15.24,-3.81; P$11 -10.16,-3.81; P$12 -15.24,-6.35; P$13 -10.16,-6.35; P$14 -15.24,-8.89; P$15 -10.16,-8.89; P$16 -15.24,-11.43; P$17 -10.16,-11.43; P$18 -15.24,-13.97; P$19 -10.16,-13.97; P$20 -15.24,-16.51; P$21 -10.16,-16.51; P$22 -15.24,-19.05; P$23 -10.16,-19.05; P$24 -15.24,-21.59; P$25 -10.16,-21.59; P$26 -7.62,-29.21; P$27 -5.08,-29.21; P$28 -5.08,-24.13; P$29 -2.54,-29.21; P$30 -2.54,-24.13; P$31 0,-29.21; P$32 0,-24.13; P$33 2.54,-29.21; P$34 2.54,-24.13; P$35 5.08,-29.21; P$36 5.08,-24.13; P$37 7.62,-29.21; P$38 7.62,-24.13; P$39 10.16,-29.21; P$40 10.16,-24.13; P$41 12.7,-29.21; P$42 12.7,-24.13; P$43 15.24,-29.21; P$44 15.24,-24.13; P$45 17.78,-29.21; P$46 17.78,-24.13; P$47 20.32,-29.21; P$48 20.32,-24.13; P$49 22.86,-29.21; P$50 22.86,-24.13; P$51 30.48,-21.59; P$52 30.48,-19.05; P$53 25.4,-19.05; P$54 30.48,-16.51; P$55 25.4,-16.51; P$56 30.48,-13.97; P$57 25.4,-13.97; P$58 30.48,-11.43; P$59 25.4,-11.43; P$60 30.48,-8.89; P$61 25.4,-8.89; P$62 30.48,-6.35; P$63 25.4,-6.35; P$64 30.48,-3.81; P$65 25.4,-3.81; P$66 30.48,-1.27; P$67 25.4,-1.27; P$68 30.48,1.27; P$69 25.4,1.27; P$70 30.48,3.81; P$71 25.4,3.81; P$72 30.48,6.35; P$73 25.4,6.35; P$74 30.48,8.89; P$75 25.4,8.89; P$76 22.86,16.51; P$77 20.32,16.51; P$78 20.32,11.43; P$79 17.78,16.51; P$80 17.78,11.43; P$81 15.24,16.51; P$82 15.24,11.43; P$83 12.7,16.51; P$84 12.7,11.43; P$85 10.16,16.51; P$86 10.16,11.43; P$87 7.62,16.51; P$88 7.62,11.43; P$89 5.08,16.51; P$90 5.08,11.43; P$91 2.54,16.51; P$92 2.54,11.43; P$93 0,16.51; P$94 0,11.43; P$95 -2.54,16.51; P$96 -2.54,11.43; P$97 -5.08,16.51; P$98 -5.08,11.43; P$99 -7.62,16.51; P$100 -7.62,11.43; P$101 -15.24,16.51; P$102 -12.7,16.51; P$103 -10.16,16.51; P$104 30.48,16.51; P$105 27.94,16.51; P$106 25.4,16.51
CSM-8A = smd 2.2 x 2.4: 1 -3.197,0.001; 2 3.1,0
TO263 = smd 10.795 x 5.08: P$1 0,8.382 | smd 1.27 x 2.54: P$2 -2.542,-2.554; P$3 -0.002,-2.54; P$4 2.538,-2.526
WIREHOLE = drill 1.143 pad 3.81 round: P$1 0,0 | drill 2.286 round: P$2 0,3.81
PAK100/2500-10 = drill 1 pad 1.422 round: 1 -5.08,-1.27; 2 -5.08,1.27; 3 -2.54,-1.27; 4 -2.54,1.27; 5 0,-1.27; 6 0,1.27; 7 2.54,-1.27; 8 2.54,1.27; 9 5.08,-1.27; 10 5.08,1.27

### Placement (x,y rotation side)
C1  19.05,134.62 90 top
C2  36.83,134.62 90 top
C3  48.26,41.91 90 top
C4  118.11,113.03 270 top
C5  43.18,52.07 0 top
C6  43.18,109.22 0 top
C7  53.34,114.3 270 top
C8  116.84,82.55 180 top
C9  66.04,72.39 90 bottom
C10  78.74,72.39 90 bottom
C11  88.9,81.28 90 bottom
C12  138.43,88.9 270 bottom
C13  135.89,29.21 270 bottom
C14  115.57,43.18 90 top
IC2  134.62,104.14 270 top
IC3  132.08,44.45 270 top
IC4  118.11,67.31 270 top
IC9  69.85,119.38 0 top
IC10  100.33,38.1 180 top
IC11  39.37,95.25 90 top
IC12  39.37,67.31 90 top
IC13  104.14,119.38 0 top
IC14  63.5,38.1 180 top
J3  144.78,45.72 90 top
J4  146.05,105.41 90 top
JP1  50.8,50.8 90 top
JP2  83.82,46.99 270 top
R1  43.18,40.64 90 top
R2  52.07,133.35 90 top
R3  57.15,133.35 90 top
R4  62.23,133.35 90 top
R5  67.31,133.35 90 top
R6  72.39,134.62 90 top
R7  77.47,134.62 90 top
R8  82.55,134.62 90 top
R9  87.63,134.62 90 top
R10  118.11,22.86 270 top
R11  113.03,22.86 270 top
R12  107.95,22.86 270 top
R13  102.87,22.86 270 top
R14  97.79,22.86 270 top
R15  92.71,22.86 270 top
R16  86.36,22.86 270 top
R17  81.28,22.86 270 top
R18  22.86,68.58 180 top
R19  22.86,73.66 180 top
R20  22.86,78.74 180 top
R21  22.86,83.82 180 top
R22  22.86,88.9 180 top
R23  22.86,93.98 180 top
R24  22.86,99.06 180 top
R25  22.86,104.14 180 top
R26  22.86,26.67 180 top
R27  22.86,31.75 180 top
R28  22.86,36.83 180 top
R29  22.86,41.91 180 top
R30  22.86,46.99 180 top
R31  22.86,52.07 180 top
R32  22.86,57.15 180 top
R33  22.86,62.23 180 top
R34  92.71,134.62 90 top
R35  97.79,134.62 90 top
R36  104.14,134.62 90 top
R37  109.22,134.62 90 top
R38  114.3,134.62 90 top
R39  119.38,134.62 90 top
R40  124.46,134.62 90 top
R41  129.54,134.62 90 top
R42  73.66,22.86 270 top
R43  68.58,22.86 270 top
R44  63.5,22.86 270 top
R45  58.42,22.86 270 top
R46  52.07,22.86 270 top
R47  46.99,22.86 270 top
R48  41.91,22.86 270 top
R49  36.83,22.86 270 top
U$1  80.01,90.17 180 bottom
U$2  69.85,88.9 0 top
U$3  72.39,69.85 0 bottom
U$4  27.94,127 0 top
U$5  25.4,143.51 0 top
U$6  30.48,143.51 0 top
X1  67.31,147.32 0 top
X2  100.33,7.62 180 top
X3  7.62,85.09 90 top
X4  7.62,49.53 90 top
X5  57.15,7.62 180 top
X6  109.22,147.32 0 top

### Tracks (layer width: path | path; a pad name or v marks a point on that pad's centre or on a via)
CLOCK  (7 unrouted)
GND  (via drill 1.5)  (2 unrouted)
  Top 0.254: 36.83,135.89 C2.- 36.83,135.38 30.48,135.38 | C1.- 19.05,135.89 19.56,135.38 U$4.P$1 | JP2.1 81.28,50.8 74.93,44.45 IC14.1 | C7.2 55.75,112.9 IC9.1 | C4.2 116.97,111.63 115.57,113.03 IC13.10 | C8.2 115.57,82.55 114.3,81.28 IC4.1 | IC10.1 114.3,44.45 115.57,44.45 C14.2 | C3.2 50.67,43.31 IC14.10 | C5.2 44.58,54.48 IC12.1 | C6.2 44.58,108.08 IC11.10
  Top 1.905: 30.48,142.24 30.48,135.38 U$4.P$1 U$4.P$3 | U$4.P$3 | v27.94,116.84 U$4.P$3
  Bottom 0.254: C11.2 92.58,82.68 93.98,81.28 99.06,81.28 U$2.P$62 | JP1.6 46.99,55.88 IC12.1
  Bottom 0.508: U$2.P$103 59.69,110.49 58.42,111.76 IC9.1 | U$2.P$101 U$2.P$102 U$2.P$103 | U$2.P$103 U$2.P$99 | U$2.P$106 U$2.P$105 U$2.P$104 | U$2.P$106 95.25,107.95 92.71,110.49 IC13.1 | U$2.P$81 87.63,102.87 93.98,102.87 95.25,104.14 U$2.P$106 | IC4.1 113.03,78.74 111.76,77.47 111.76,55.88 | IC10.1 111.76,55.88 | 111.76,55.88 IC4.10 | 60.96,85.09 U$2.P$11 | 60.96,85.09 62.23,86.36 62.23,96.52 59.69,99.06 U$2.P$103 | C9.2 66.04,80.01 60.96,85.09 | C9.2 78.61,73.79 78.74,73.66 | U$2.P$32 67.31,67.31 63.5,67.31 62.23,68.58 62.23,72.39 63.5,73.66 66.04,73.66 C9.2 | 78.74,73.66 C10.2 | 80.01,82.55 80.01,74.93 78.74,73.66 | 80.01,82.55 U$1.4 | C11.2 80.14,82.68 80.01,82.55
  Bottom 1.905: v27.94,116.84 33.02,111.76 38.1,111.76 39.37,110.49 | 39.37,55.88 39.37,44.45 45.72,38.1 52.07,38.1 | 39.37,55.88 39.37,78.74 | 39.37,78.74 39.37,83.82 | 39.37,83.82 39.37,106.68 | 39.37,106.68 39.37,110.49 | 52.07,38.1 74.93,38.1 | 74.93,38.1 88.9,38.1 | 88.9,38.1 111.76,38.1 | 111.76,38.1 116.84,38.1 | 111.76,38.1 IC10.1 | 88.9,38.1 IC10.10 | 74.93,38.1 IC14.1 | 52.07,38.1 IC14.10 | 39.37,55.88 IC12.1 | 39.37,78.74 IC12.10 | 39.37,83.82 IC11.1 | 39.37,106.68 IC11.10 | 39.37,110.49 39.37,113.03 45.72,119.38 58.42,119.38 | 58.42,119.38 81.28,119.38 | 81.28,119.38 92.71,119.38 | 92.71,119.38 115.57,119.38 | 58.42,119.38 IC9.1 | 81.28,119.38 IC9.10 | 92.71,119.38 IC13.1 | 115.57,119.38 IC13.10 | 115.57,119.38 133.35,119.38 134.62,118.11 134.62,93.98 | 134.62,93.98 134.62,87.63 | 134.62,87.63 134.62,60.96 132.08,58.42 132.08,34.29 | 132.08,34.29 132.08,29.21 133.48,27.81 C13.2 | 134.62,93.98 IC2.9 | 132.08,34.29 IC3.9 | C12.2 134.75,87.5 134.62,87.63
N$1
  Bottom 0.254: U$2.P$34 72.39,66.04 75.59,69.24 U$3.1 77.47,69.85 78.74,71.12 C10.1
N$2
  Bottom 0.254: U$2.P$33 71.12,60.96 71.12,67.31 69.29,69.14 U$3.2 67.31,69.85 66.04,71.12 C9.1
N$3  (1 unrouted)
  Bottom 0.254: U$2.P$30 66.04,63.5 66.04,58.42 60.96,53.34 JP1.5 50.8,52.07 48.26,52.07 R1.2
N$4
  Top 0.254: JP1.3 53.34,50.8 54.61,52.07 54.61,62.23 52.07,64.77 52.07,71.12 53.34,72.39 U$2.P$20
N$5
  Top 0.254: JP1.4 50.8,52.07 50.8,71.12 53.34,73.66 58.42,73.66 U$2.P$21
N$6
  Top 0.254: JP1.1 55.88,52.07 55.88,68.58 U$2.P$22
N$7
  Bottom 0.254: IC9.19 60.96,124.46 59.69,125.73 59.69,128.27 58.42,129.54 54.61,129.54 R2.1
N$8
  Top 0.254: IC9.18 59.69,127 R3.1
N$9
  Top 0.254: IC9.17 66.04,125.73 64.77,127 R4.1
N$10
  Top 0.254: IC9.16 68.58,125.73 R5.1
N$11
  Top 0.254: IC9.15 71.12,127 R6.1
N$12
  Top 0.254: IC9.14 73.66,125.73 76.2,128.27 R7.1
N$13
  Top 0.254: IC9.13 76.2,124.46 78.74,127 81.28,127 R8.1
N$14
  Top 0.254: IC9.12 78.74,124.46 80.01,125.73 85.09,125.73 R9.1
N$15
  Top 0.254: IC10.19 109.22,33.02 110.49,31.75 115.57,31.75 R10.1
N$16
  Top 0.254: IC10.18 106.68,33.02 109.22,30.48 111.76,30.48 R11.1
N$17
  Top 0.254: IC10.17 104.14,33.02 R12.1
N$18
  Top 0.254: IC10.16 101.6,30.48 R13.1
N$19
  Top 0.254: IC10.15 99.06,30.48 R14.1
N$20
  Top 0.254: IC10.14 96.52,31.75 95.25,30.48 93.98,30.48 R15.1
N$21
  Top 0.254: IC10.13 93.98,33.02 91.44,30.48 87.63,30.48 R16.1
N$22
  Top 0.254: IC10.12 91.44,33.02 90.17,31.75 83.82,31.75 R17.1
N$23
  Bottom 0.254: R18.1 29.21,71.12 31.75,73.66 31.75,80.01 33.02,81.28 33.02,85.09 34.29,86.36 IC11.19
N$24
  Top 1.27: IC3.11 137.16,36.83 139.7,34.29 139.7,33.02 144.78,27.94 J3.8
N$25
  Top 1.27: J3.7 144.78,33.02 138.43,39.37 IC3.12
N$26
  Top 1.27: J3.6 144.78,38.1 140.97,41.91 IC3.13
N$27
  Top 1.27: J3.5 144.78,43.18 143.51,44.45 IC3.14
N$28
  Top 1.27: J3.4 144.78,48.26 143.51,46.99 IC3.15
N$29
  Top 1.27: IC3.16 142.24,49.53 144.78,52.07 J3.3 144.78,53.34
N$30
  Top 1.27: J3.2 144.78,58.42 138.43,52.07 IC3.17
N$31
  Top 1.27: J3.1 144.78,63.5 IC3.18
N$32
  Top 1.27: J4.1 146.05,123.19 138.43,115.57 IC2.18
N$33
  Top 1.27: J4.2 146.05,118.11 139.7,111.76 IC2.17
N$34
  Top 1.27: J4.3 146.05,113.03 142.24,109.22 IC2.16
N$35
  Top 1.27: J4.4 146.05,107.95 144.78,106.68 IC2.15
N$36
  Top 1.27: J4.5 146.05,102.87 144.78,104.14 IC2.14
N$37
  Top 1.27: J4.6 146.05,97.79 142.24,101.6 IC2.13
N$38
  Top 1.27: IC2.12 140.97,99.06 144.78,95.25 144.78,93.98 146.05,92.71 J4.7
N$39
  Top 1.27: IC2.11 139.7,96.52 142.24,93.98 142.24,91.44 146.05,87.63 J4.8
N$40
  Top 0.254: R19.1 29.21,76.2 31.75,78.74 31.75,86.36 34.29,88.9 IC11.18
N$41
  Bottom 0.254: R20.1 29.21,81.28 31.75,83.82 31.75,88.9 34.29,91.44 IC11.17
N$42
  Top 0.254: R21.1 29.21,86.36 31.75,88.9 31.75,91.44 34.29,93.98 IC11.16
N$43
  Top 0.254: R22.1 29.21,91.44 34.29,96.52 IC11.15
N$44
  Top 0.254: R23.1 29.21,96.52 31.75,99.06 IC11.14
N$45
  Top 0.254: R24.1 29.21,100.33 30.48,101.6 IC11.13
N$46
  Top 0.254: R25.1 IC11.12
N$47
  Bottom 0.254: R26.1 29.21,27.94 31.75,30.48 31.75,52.07 33.02,53.34 33.02,57.15 34.29,58.42 IC12.19
N$48
  Top 0.254: R27.1 29.21,34.29 30.48,35.56 30.48,49.53 31.75,50.8 31.75,58.42 34.29,60.96 IC12.18
N$49
  Bottom 0.254: R28.1 29.21,38.1 26.67,40.64 26.67,41.91 30.48,45.72 30.48,53.34 31.75,54.61 31.75,62.23 33.02,63.5 IC12.17
N$50
  Top 0.254: R29.1 29.21,43.18 26.67,45.72 26.67,46.99 30.48,50.8 30.48,58.42 31.75,59.69 31.75,64.77 33.02,66.04 IC12.16
N$51
  Bottom 0.254: R30.1 29.21,48.26 26.67,50.8 26.67,52.07 30.48,55.88 30.48,64.77 31.75,66.04 31.75,67.31 33.02,68.58 IC12.15
N$52
  Top 0.254: R31.1 29.21,53.34 26.67,55.88 26.67,57.15 30.48,60.96 30.48,68.58 33.02,71.12 IC12.14
N$53
  Bottom 0.254: R32.1 29.21,58.42 26.67,60.96 26.67,63.5 30.48,67.31 30.48,71.12 33.02,73.66 IC12.13
N$54
  Top 0.254: R33.1 29.21,63.5 26.67,66.04 26.67,68.58 31.75,73.66 31.75,74.93 33.02,76.2 IC12.12
N$55
  Top 0.254: X1.1 58.42,146.05 R2.2
N$56
  Bottom 0.254: R3.2 57.15,143.51 X1.2
N$57
  Top 0.254: R4.2 62.23,143.51 X1.3
N$58
  Bottom 0.254: X1.4 66.04,147.32 66.04,140.97 R5.2
N$59
  Top 0.254: X1.5 R6.2
N$60
  Bottom 0.254: X1.6 68.58,147.32 68.58,144.78 69.85,143.51 74.93,143.51 R7.2
N$61
  Top 0.254: X1.7 72.39,143.51 80.01,143.51 R8.2
N$62
  Top 0.254: X1.8 71.12,147.32 81.28,147.32 R9.2
N$63
  Top 0.254: X2.1 110.49,8.89 R10.2
N$64
  Bottom 0.254: X2.2 113.03,13.97 R11.2
N$65
  Top 0.254: X2.3 107.95,13.97 R12.2
N$66
  Top 0.254: X2.4 101.6,7.62 101.6,15.24 R13.2
N$67
  Top 0.254: X2.5 100.33,13.97 R14.2
N$68
  Top 0.254: X2.6 99.06,7.62 99.06,11.43 96.52,13.97 95.25,13.97 R15.2
N$69
  Top 0.254: X2.7 97.79,10.16 95.25,12.7 90.17,12.7 R16.2
N$70
  Top 0.254: R17.2 90.17,7.62 96.52,7.62 X2.8
N$71
  Top 0.254: X3.1 8.89,76.2 R18.2
N$72
  Bottom 0.254: X3.2 12.7,73.66 R19.2
N$73
  Top 0.254: X3.3 12.7,82.55 R20.2
N$74
  Top 0.254: X3.4 7.62,83.82 R21.2
N$75
  Top 0.254: X3.5 12.7,85.09 R22.2
N$76
  Top 0.254: X3.6 7.62,86.36 11.43,86.36 12.7,87.63 12.7,88.9 13.97,90.17 13.97,91.44 R23.2
N$77
  Top 0.254: X3.7 12.7,91.44 12.7,95.25 R24.2
N$78
  Top 0.254: X3.8 7.62,88.9 7.62,95.25 R25.2
N$79
  Top 0.254: X4.1 8.89,34.29 R26.2
N$80
  Bottom 0.254: X4.2 6.35,41.91 R27.2
N$81
  Top 0.254: X4.8 7.62,53.34 7.62,57.15 12.7,62.23 R33.2
N$82
  Top 0.254: X4.7 11.43,52.07 R32.2
N$83
  Top 0.254: X4.6 7.62,50.8 15.24,50.8 R31.2
N$84
  Top 0.254: X4.5 13.97,49.53 R30.2
N$85
  Bottom 0.254: X4.4 7.62,45.72 12.7,45.72 R29.2
N$86
  Top 0.254: X4.3 11.43,46.99 13.97,44.45 13.97,39.37 R28.2
N$87
  Top 0.254: R34.2 92.71,143.51 95.25,146.05 X6.1
N$88
  Bottom 0.254: R35.2 97.79,142.24 X6.2
N$89
  Top 0.254: R36.2 104.14,143.51 X6.3
N$90
  Bottom 0.254: X6.4 107.95,147.32 107.95,142.24 R37.2
N$91
  Top 0.254: X6.5 R38.2
N$92
  Bottom 0.254: X6.6 110.49,147.32 110.49,144.78 111.76,143.51 116.84,143.51 R39.2
N$93
  Top 0.254: X6.7 114.3,143.51 121.92,143.51 R40.2
N$94
  Top 0.254: X6.8 113.03,147.32 123.19,147.32 R41.2
N$95
  Top 0.254: X5.1 66.04,8.89 R42.2
N$96
  Bottom 0.254: X5.2 63.5,6.35 68.58,11.43 R43.2
N$97
  Top 0.254: X5.3 63.5,12.7 R44.2
N$98
  Bottom 0.254: X5.4 58.42,7.62 R45.2
N$99
  Top 0.254: X5.5 57.15,11.43 R46.2
N$100
  Bottom 0.254: X5.6 55.88,7.62 55.88,10.16 53.34,12.7 50.8,12.7 R47.2
N$101
  Top 0.254: X5.7 50.8,12.7 45.72,12.7 R48.2
N$102
  Top 0.254: X5.8 53.34,7.62 45.72,7.62 R49.2
N$103
  Top 0.254: IC13.19 95.25,125.73 R34.1
N$104
  Top 0.254: IC13.18 R35.1
N$105
  Top 0.254: IC13.17 100.33,127 101.6,128.27 R36.1
N$106
  Bottom 0.254: IC13.16 102.87,124.46 106.68,128.27 R37.1
N$107
  Top 0.254: IC13.15 105.41,127 106.68,128.27 106.68,129.54 107.95,130.81 111.76,130.81 R38.1
N$108
  Top 0.254: IC13.14 107.95,124.46 109.22,125.73 116.84,125.73 R39.1
N$109
  Bottom 0.254: IC13.13 110.49,125.73 111.76,127 111.76,129.54 113.03,130.81 121.92,130.81 R40.1
N$110
  Bottom 0.254: IC13.12 113.03,124.46 114.3,125.73 127,125.73 R41.1
N$111
  Top 0.254: IC14.19 72.39,30.48 R42.1
N$112
  Top 0.254: IC14.18 69.85,30.48 R43.1
N$113
  Top 0.254: IC14.17 67.31,33.02 R44.1
N$114
  Top 0.254: IC14.16 64.77,33.02 63.5,31.75 60.96,31.75 R45.1
N$115
  Bottom 0.254: R46.1 54.61,29.21 57.15,31.75 60.96,31.75 62.23,33.02 IC14.15
N$116
  Top 0.254: IC14.14 59.69,33.02 52.07,25.4 50.8,25.4 R47.1
N$117
  Bottom 0.254: IC14.13 54.61,31.75 44.45,31.75 R48.1
N$118
  Top 0.254: R49.1 39.37,31.75 52.07,31.75 IC14.12
N$119
  Bottom 1.905: C12.1 IC2.10
N$120
  Bottom 1.905: C13.1 IC3.10
N$121
  Top 0.254: U$2.P$46 86.36,63.5 86.36,49.53 85.09,48.26 JP2.2
N$122
  Top 0.254: U$2.P$45 87.63,45.72 85.09,43.18 JP2.4
OUT1  (2 unrouted)
  Top 0.254: IC4.3 116.84,73.66 119.38,76.2 IC4.19
OUT2  (2 unrouted)
  Top 0.254: IC4.4 116.84,71.12 119.38,73.66 IC4.18
OUT3  (2 unrouted)
  Top 0.254: IC4.17 119.38,71.12 116.84,68.58 IC4.5
OUT4  (2 unrouted)
  Top 0.254: IC4.6 116.84,66.04 119.38,68.58 IC4.16
OUT5  (2 unrouted)
  Top 0.254: IC4.15 119.38,66.04 116.84,63.5 IC4.7
OUT6  (2 unrouted)
  Top 0.254: IC4.8 116.84,60.96 119.38,63.5 IC4.14
OUT7  (2 unrouted)
  Top 0.254: IC4.13 119.38,60.96 116.84,58.42 IC4.9
OUT8  (2 unrouted)
PA0  (1 unrouted)
PA1  (1 unrouted)
PA2  (1 unrouted)
PA3  (1 unrouted)
PA4  (1 unrouted)
PA5  (1 unrouted)
PA6  (1 unrouted)
PA7  (1 unrouted)
PC0
  Top 0.254: IC10.9 91.44,52.07 95.25,55.88 U$2.P$53
PC1
  Bottom 0.254: IC10.8 93.98,49.53 102.87,58.42 102.87,71.12 101.6,72.39 U$2.P$54
PC2
  Top 0.254: IC10.7 96.52,43.18 97.79,44.45 97.79,71.12 96.52,72.39 U$2.P$55
PC3
  Top 0.254: U$2.P$56 102.87,74.93 106.68,71.12 106.68,52.07 104.14,49.53 100.33,49.53 99.06,48.26 IC10.6
PC4
  Bottom 0.254: IC10.5 101.6,44.45 105.41,48.26 105.41,71.12 102.87,73.66 96.52,73.66 U$2.P$57
PC5
  Top 0.254: IC10.4 104.14,48.26 107.95,52.07 107.95,76.2 106.68,77.47 U$2.P$58
PC6
  Bottom 0.254: IC10.3 106.68,74.93 105.41,76.2 96.52,76.2 U$2.P$59
PC7
  Top 0.254: IC10.2 109.22,78.74 107.95,80.01 U$2.P$60
PE0
  Top 0.254: IC11.9 48.26,104.14 52.07,100.33 52.07,97.79 U$2.P$2
PE1
  Bottom 0.254: IC11.8 53.34,101.6 U$2.P$3
PE2
  Top 0.254: U$2.P$4 48.26,99.06 IC11.7
PE3
  Bottom 0.254: IC11.6 49.53,96.52 52.07,93.98 58.42,93.98 U$2.P$5
PE4
  Top 0.254: U$2.P$6 53.34,90.17 49.53,93.98 IC11.5
PE5
  Top 0.254: IC11.4 49.53,91.44 52.07,88.9 58.42,88.9 U$2.P$7
PE6
  Top 0.254: IC11.3 49.53,88.9 50.8,87.63 U$2.P$8
PE7
  Top 0.254: IC11.2 57.15,86.36 58.42,87.63 U$2.P$9
PH0
  Top 0.254: U$2.P$12 48.26,82.55 46.99,81.28 46.99,78.74 44.45,76.2 IC12.9
PH1
  Top 0.254: IC12.8 44.45,73.66 52.07,81.28 58.42,81.28 U$2.P$13
PH2
  Top 0.254: IC12.7 44.45,71.12 53.34,80.01 U$2.P$14
PH3
  Bottom 0.254: IC12.6 44.45,68.58 45.72,69.85 45.72,74.93 49.53,78.74 58.42,78.74 U$2.P$15
PH4
  Top 0.254: U$2.P$16 53.34,77.47 46.99,71.12 46.99,68.58 44.45,66.04 IC12.5
PH5
  Bottom 0.254: IC12.4 44.45,63.5 49.53,68.58 49.53,73.66 52.07,76.2 58.42,76.2 U$2.P$17
PH6
  Top 0.254: IC12.3 44.45,60.96 48.26,64.77 48.26,69.85 53.34,74.93 U$2.P$18
PH7
  Bottom 0.254: IC12.2 58.42,58.42 59.69,57.15 63.5,57.15 64.77,58.42 U$2.P$27
PJ0
  Top 0.254: U$2.P$63 96.52,83.82 109.22,83.82 118.11,92.71 118.11,107.95 113.03,113.03 IC13.9
PJ1
  Top 0.254: U$2.P$64 107.95,85.09 115.57,92.71 115.57,107.95 110.49,113.03 IC13.8
PJ2
  Top 0.254: U$2.P$65 96.52,86.36 106.68,86.36 113.03,92.71 113.03,106.68 107.95,111.76 IC13.7
PJ3
  Top 0.254: U$2.P$66 105.41,87.63 110.49,92.71 110.49,106.68 105.41,111.76 IC13.6
PJ4
  Bottom 0.254: IC13.5 102.87,111.76 107.95,106.68 107.95,91.44 105.41,88.9 96.52,88.9 U$2.P$67
PJ5
  Top 0.254: U$2.P$68 105.41,90.17 107.95,92.71 107.95,106.68 100.33,114.3 IC13.4
PJ6
  Top 0.254: IC13.3 97.79,114.3 105.41,106.68 105.41,92.71 104.14,91.44 96.52,91.44 U$2.P$69
PJ7
  Top 0.254: IC13.2 95.25,110.49 93.98,109.22 90.17,109.22 87.63,106.68 U$2.P$79
PK1
  Top 0.254: U$2.P$88 77.47,99.06 92.71,83.82 92.71,82.55 93.98,81.28 109.22,81.28 110.49,80.01 110.49,78.74 113.03,76.2 IC4.2
PL0
  Top 0.254: IC14.9 54.61,45.72 63.5,54.61 71.12,54.61 74.93,58.42 U$2.P$35
PL1
  Bottom 0.254: IC14.8 57.15,45.72 67.31,55.88 71.12,55.88 73.66,58.42 73.66,63.5 U$2.P$36
PL2
  Top 0.254: IC14.7 59.69,43.18 68.58,52.07 72.39,52.07 77.47,57.15 U$2.P$37
PL3
  Bottom 0.254: IC14.6 62.23,46.99 68.58,53.34 73.66,53.34 76.2,55.88 76.2,63.5 U$2.P$38
PL4
  Top 0.254: IC14.5 64.77,43.18 71.12,49.53 73.66,49.53 80.01,55.88 U$2.P$39
PL5
  Bottom 0.254: IC14.4 67.31,48.26 69.85,50.8 74.93,50.8 78.74,54.61 78.74,63.5 U$2.P$40
PL6
  Top 0.254: IC14.3 69.85,43.18 73.66,46.99 74.93,46.99 82.55,54.61 U$2.P$41
PL7
  Bottom 0.254: IC14.2 72.39,45.72 81.28,54.61 81.28,63.5 U$2.P$42
V+
  Top 0.254: C1.+ 19.05,133.35 15.24,129.54
  Top 1.905: U$5.P$1 19.05,143.51 15.24,139.7 15.24,129.54 20.32,124.46 U$4.P$2
VCC  (1 unrouted)
  Top 0.254: U$4.P$4 33.03,124.47 36.83,128.27 C2.+ | JP2.3 81.28,45.72 78.74,43.18 78.74,38.1 | 53.34,119.38 C7.1 | C4.1 120.78,114.43 121.92,115.57 | 121.92,82.55 C8.1 | 115.57,38.1 C14.1 | 48.26,38.1 C3.1 | 39.37,52.07 C5.1 | 39.37,109.22 C6.1 | R1.1 45.72,34.29 46.99,35.56 46.99,38.1
  Top 0.508: U$2.P$10 48.26,85.09 44.45,81.28 39.37,81.28 | 40.64,43.18 41.91,43.18 | U$2.P$100 55.88,100.33 48.26,107.95 48.26,119.38 | 39.37,49.53 45.72,49.53 46.99,48.26 JP1.2
  Top 1.905: 30.48,121.92 U$4.P$4 | 30.48,121.92 33.02,119.38 48.26,119.38 53.34,119.38 58.42,119.38 | 58.42,119.38 92.71,119.38 | 92.71,119.38 119.38,119.38 121.92,116.84 121.92,115.57 121.92,82.55 IC4.20 | 58.42,119.38 IC9.20 | 92.71,119.38 IC13.20 | 30.48,121.92 30.48,119.38 39.37,110.49 39.37,109.22 39.37,83.82 | 39.37,55.88 39.37,81.28 39.37,83.82 | 39.37,55.88 IC12.20 | 39.37,83.82 IC11.20 | 39.37,55.88 39.37,52.07 39.37,49.53 39.37,44.45 40.64,43.18 45.72,38.1 46.99,38.1 48.26,38.1 74.93,38.1 | 74.93,38.1 78.74,38.1 111.76,38.1 | 111.76,38.1 115.57,38.1 116.84,38.1 | 74.93,38.1 IC14.20 | 111.76,38.1 IC10.20
  Bottom 0.254: C11.1 95.12,79.88 U$2.P$61 | 77.7,95.25 U$1.1 | 77.7,95.25 77.7,95.48 78.74,96.52 86.36,96.52 87.63,97.79 U$2.P$80 | U$2.P$100 67.31,95.25 77.7,95.25
  Bottom 0.508: U$2.P$31 69.85,58.42 68.58,57.15 66.04,57.15 54.61,45.72 50.8,45.72 49.53,46.99 JP1.2